# EAGLE design bpf_915 (EAGLE 7.6.0)
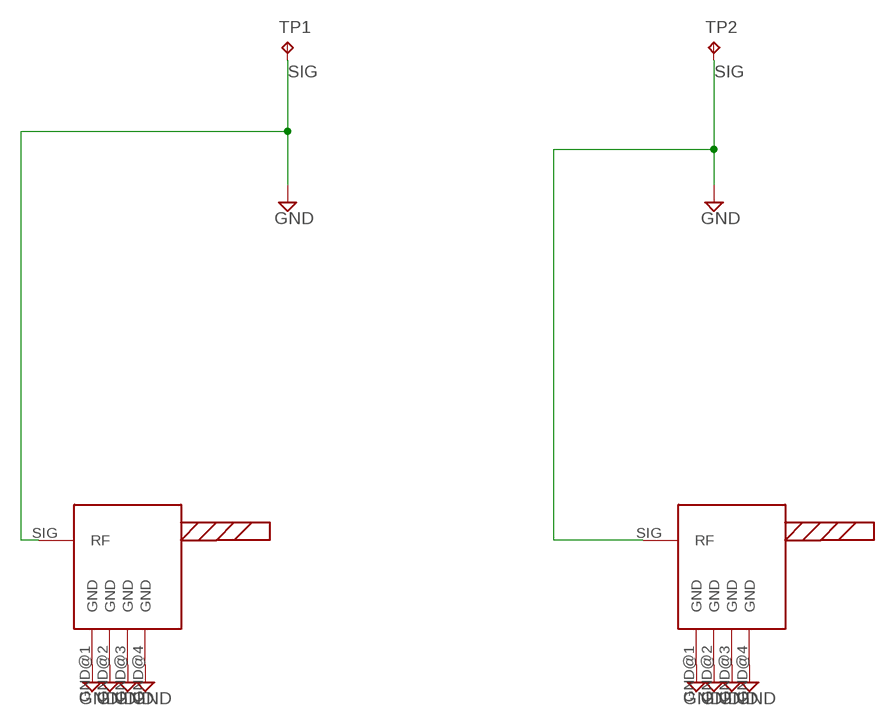
[diagram p0: schematic, sheet 1]

## Parts
J1  MMCX-J-P-X-RA-SM1SMD  [MMCX-J-P-X-RA-SM1_SAMTEC]
J2  MMCX-J-P-X-RA-SM1SMD  [MMCX-J-P-X-RA-SM1_SAMTEC]
TP1  TPTP10SQ  [TP10SQ]
TP2  TPTP10SQ  [TP10SQ]

## Nets
SIG: J1.GND@1(GND) J1.GND@2(GND) J1.GND@3(GND) J1.GND@4(GND) J1.SIG(RF) J2.GND@1(GND) J2.GND@2(GND) J2.GND@3(GND) J2.GND@4(GND) J2.SIG(RF) ; supply symbol labelled GND
Unconnected: TP1.TP TP2.TP

## Library data of the parts
J1 J2 = 195Ec_300-0004-01_rev1_b:MMCX-J-P-X-RA-SM1
TP1 TP2 = testpad:TP: Test pad

## Board
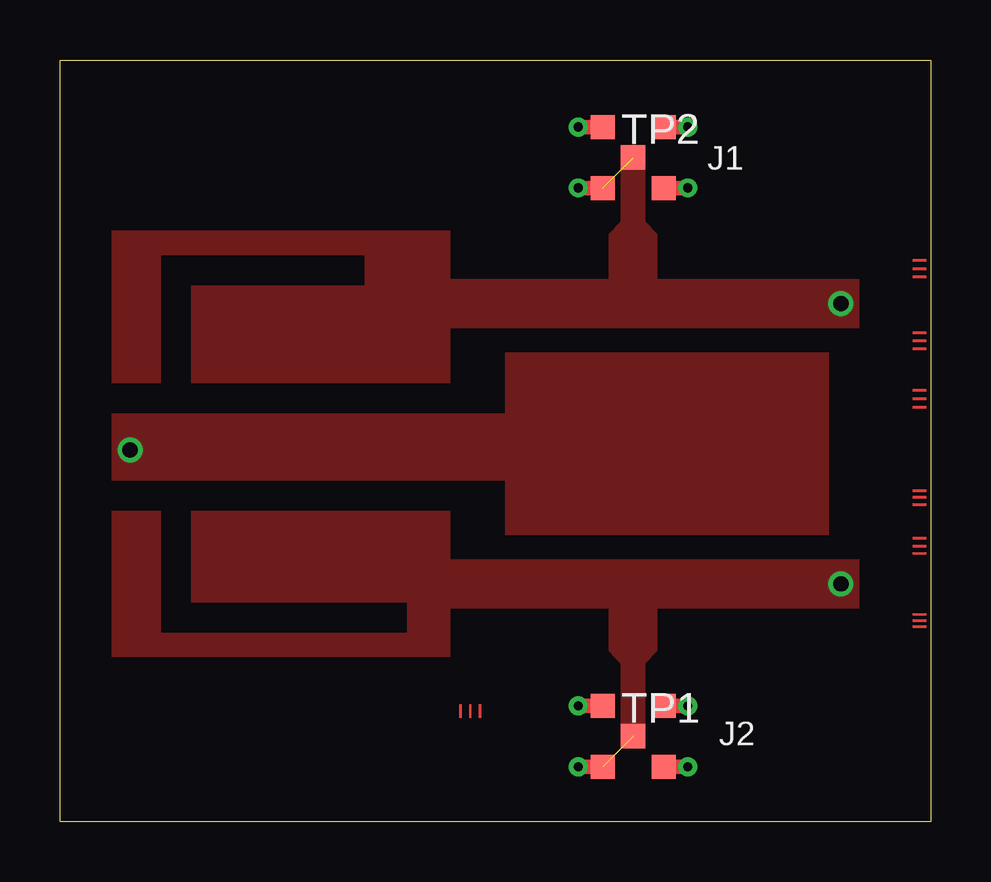
[diagram p1: board, top side]
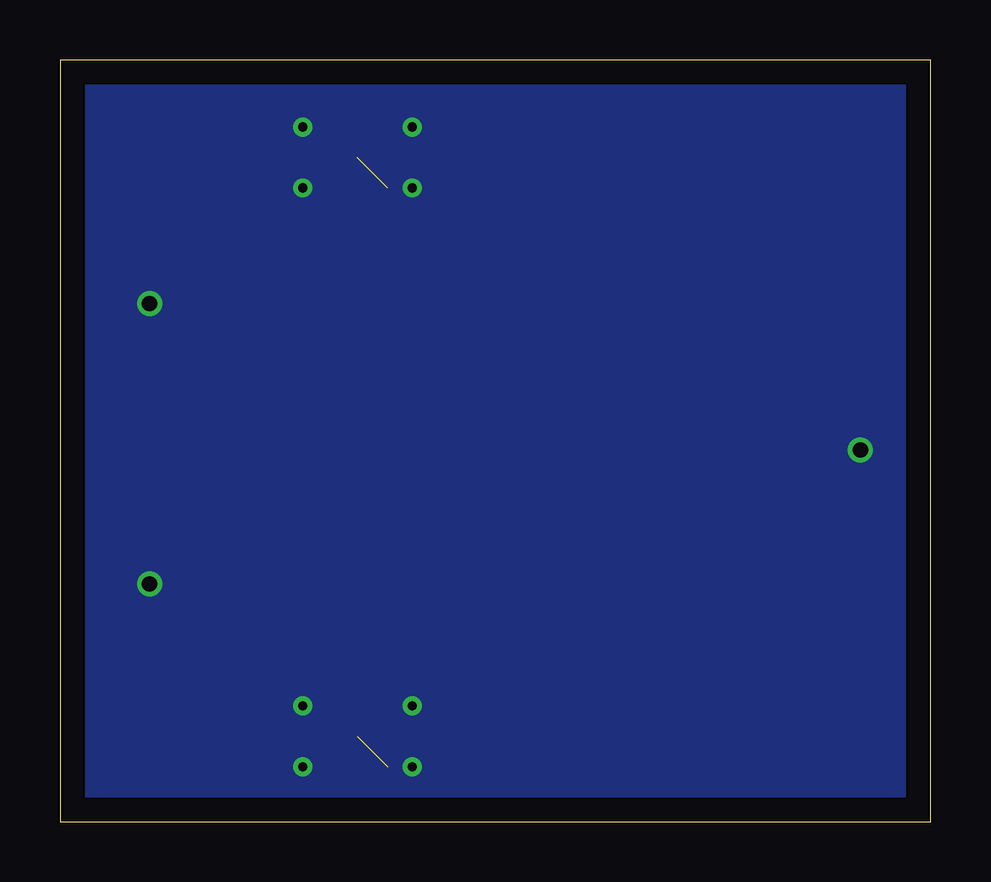
[diagram p2: board, bottom side, seen from below]

Size 36.27 x 31.75 mm. Coordinates in mm from the lower left corner, seen from the top.
Outline: 0,31.75 36.27,31.75 36.27,0 0,0 0,31.75
Copper layers (1*16): Top 0.035mm / dielectric 1.5mm / Bottom 0.035mm
Design rules "default *": minimum track width 10mil, minimum drill 24mil, track to track 0mil, track to pad 0mil, pad to pad 0mil, via to via 0mil, smd to smd 0mil, copper to edge 40mil, drill to drill 8mil, minimum pad ring 10mil, minimum via ring 8mil, stop-mask expansion 0mil, vias tented up to drill 35mil, thermal gap 10mil

### Footprints (pad centres in the part's own frame; a part is rotated, then mirrored left to right if it is on the bottom)
MMCX-J-P-X-RA-SM1_SAMTEC = smd 1 x 1: GND@1 -1.27,1.27; GND@2 1.27,1.27; GND@3 1.27,-1.27; GND@4 -1.27,-1.27 | smd 1.016 x 1.016: SIG 0,0
TP10SQ = smd 1.016 x 1.016: TP 0,0

### Placement (x,y rotation side)
J1  23.88,27.69 180 top
J2  23.88,3.56 0 top
TP1  23.88,3.56 0 top
TP2  23.88,27.69 0 top

### Tracks (layer width: path | path; a pad name or v marks a point on that pad's centre or on a via)
SIG  (via drill 0.38, 0.64)  (2 unrouted)
  Top 0.61: J1.GND@3 v21.59,28.96 | J1.GND@4 v26.16,28.96 | J1.GND@1 v26.16,26.42 | J1.GND@2 v21.59,26.42 | J2.GND@1 v21.59,4.83 | J2.GND@2 v26.16,4.83 | J2.GND@3 v26.16,2.29 | J2.GND@4 v21.59,2.29
  other vias: 32.54,21.59 32.54,9.91 2.92,15.49
  pour Top (no thermals): 2.16,17.02 18.54,17.02 18.54,19.56 32.03,19.56 32.03,11.94 18.54,11.94 18.54,14.22 2.16,14.22
  pour Top (no thermals): 2.16,18.29 2.16,24.64 16.26,24.64 16.26,22.61 22.86,22.61 22.86,24.49 24.89,24.49 24.89,22.61 33.3,22.61 33.3,20.57 16.26,20.57 16.26,18.29 5.46,18.29 5.46,22.35 12.7,22.35 12.7,23.62 4.19,23.62 4.19,18.29
  pour Top (no thermals): 2.16,12.95 2.16,6.86 16.26,6.86 16.26,8.89 22.86,8.89 22.86,7.11 24.89,7.11 24.89,8.89 33.3,8.89 33.3,10.92 16.26,10.92 16.26,12.95 5.46,12.95 5.46,9.14 14.48,9.14 14.48,7.87 4.19,7.87 4.19,12.95
  pour Bottom: 0.51,31.24 35.46,31.24 35.46,0.51 0.51,0.51
  pour Top (no thermals): 22.86,7.11 23.37,6.58 23.37,3.84 24.38,3.84 24.38,6.6 24.89,7.11
  pour Top (no thermals): 24.89,24.49 24.38,25.02 24.38,27.81 23.37,27.81 23.37,25.02 22.86,24.49
(copper drawn outside any net)
  shapes: Top area x21